# EAGLE schematic ArithLogicSlice (EAGLE 6.5.0)
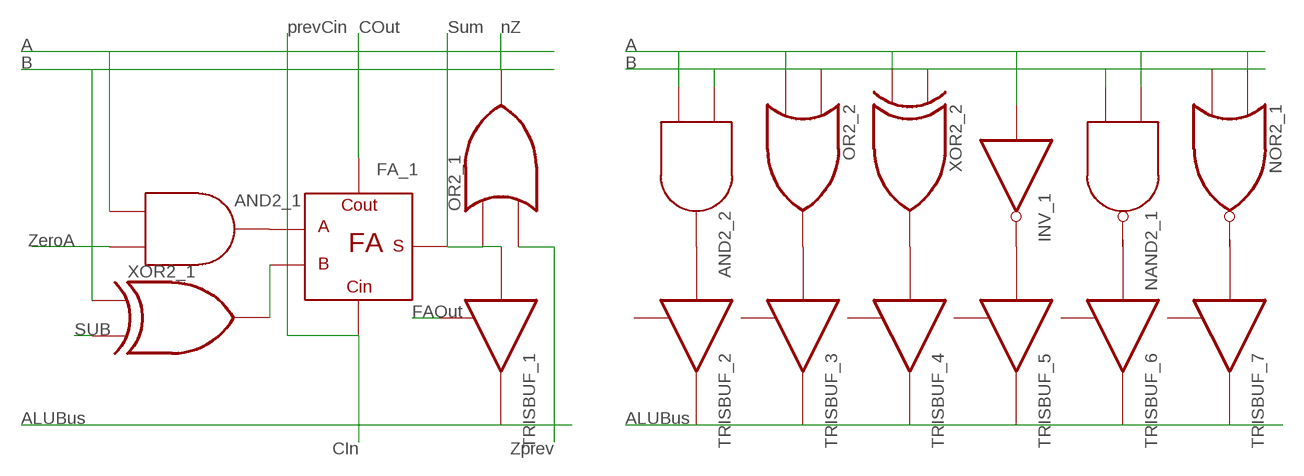
[diagram p0: schematic, sheet 1]

## Parts
AND2_1  AND2  [3PIN]
AND2_2  AND2  [3PIN]
FA_1  FULLADDER  [5PIN]
INV_1  INV  [3PIN]
NAND2_1  NAND2  [3PIN]
NOR2_1  NOR2  [3PIN]
OR2_1  OR2  [3PIN]
OR2_2  OR2  [3PIN]
TRISBUF_1  TRISBUF  [3PIN]
TRISBUF_2  TRISBUF  [3PIN]
TRISBUF_3  TRISBUF  [3PIN]
TRISBUF_4  TRISBUF  [3PIN]
TRISBUF_5  TRISBUF  [3PIN]
TRISBUF_6  TRISBUF  [3PIN]
TRISBUF_7  TRISBUF  [3PIN]
XOR2_1  XOR2  [3PIN]
XOR2_2  XOR2  [3PIN]

## Nets
N$1: AND2_2.P$3(O) TRISBUF_2.P$1(I)
N$2: OR2_2.P$3(O) TRISBUF_3.P$1(I)
N$3: TRISBUF_4.P$1(I) XOR2_2.P$3(O)
N$4: INV_1.P$2(O) TRISBUF_5.P$1(I)
N$5: NAND2_1.P$3(O) TRISBUF_6.P$1(I)
N$6: NOR2_1.P$3(O) TRISBUF_7.P$1(I)
N$9: AND2_2.P$1(A) AND2_2.P$2(I1) INV_1.P$1(I) NAND2_1.P$1(A) NAND2_1.P$2(I1) OR2_2.P$2(I1) XOR2_2.P$2(I1)
N$13: AND2_1.P$3(O) FA_1.P$1(A)
N$14: FA_1.P$2(B) XOR2_1.P$3(O)
N$15: XOR2_1.P$2(I1)
N$16: FA_1.P$4(COUT)
N$17: TRISBUF_1.P$3
N$18: FA_1.P$5(S) OR2_1.P$1(I0) TRISBUF_1.P$1(I)
N$19: OR2_1.P$2(I1)
N$20: OR2_1.P$3(O)
N$22: TRISBUF_1.P$2(O)
N$23: XOR2_1.P$1(I0)
N$24: AND2_1.P$1(A)
N$25: FA_1.P$3(CIN)
Unconnected: AND2_1.P$2(I1) NOR2_1.P$1(I0) NOR2_1.P$2(I1) OR2_2.P$1(I0) TRISBUF_2.P$2(O) TRISBUF_2.P$3 TRISBUF_3.P$2(O) TRISBUF_3.P$3 TRISBUF_4.P$2(O) TRISBUF_4.P$3 TRISBUF_5.P$2(O) TRISBUF_5.P$3 TRISBUF_6.P$2(O) TRISBUF_6.P$3 TRISBUF_7.P$2(O) TRISBUF_7.P$3 XOR2_2.P$1(I0)

## Notes on the sheet
- prevCin | COut | Sum | nZ
- A | A
- B | B
- ZeroA
- FAOut
- SUB
- ALUBus | ALUBus
- CIn | Zprev

## Library data of the parts
AND2_1 AND2_2 = c035u:AND2
FA_1 = c035u:FULLADDER
INV_1 = c035u:INV
NAND2_1 = c035u:NAND2
NOR2_1 = c035u:NOR2
OR2_1 OR2_2 = c035u:OR2
TRISBUF_1-TRISBUF_7 = c035u:TRISBUF
XOR2_1 XOR2_2 = c035u:XOR2